# Altium schematic sheet pwr_misc.SchDoc
size B
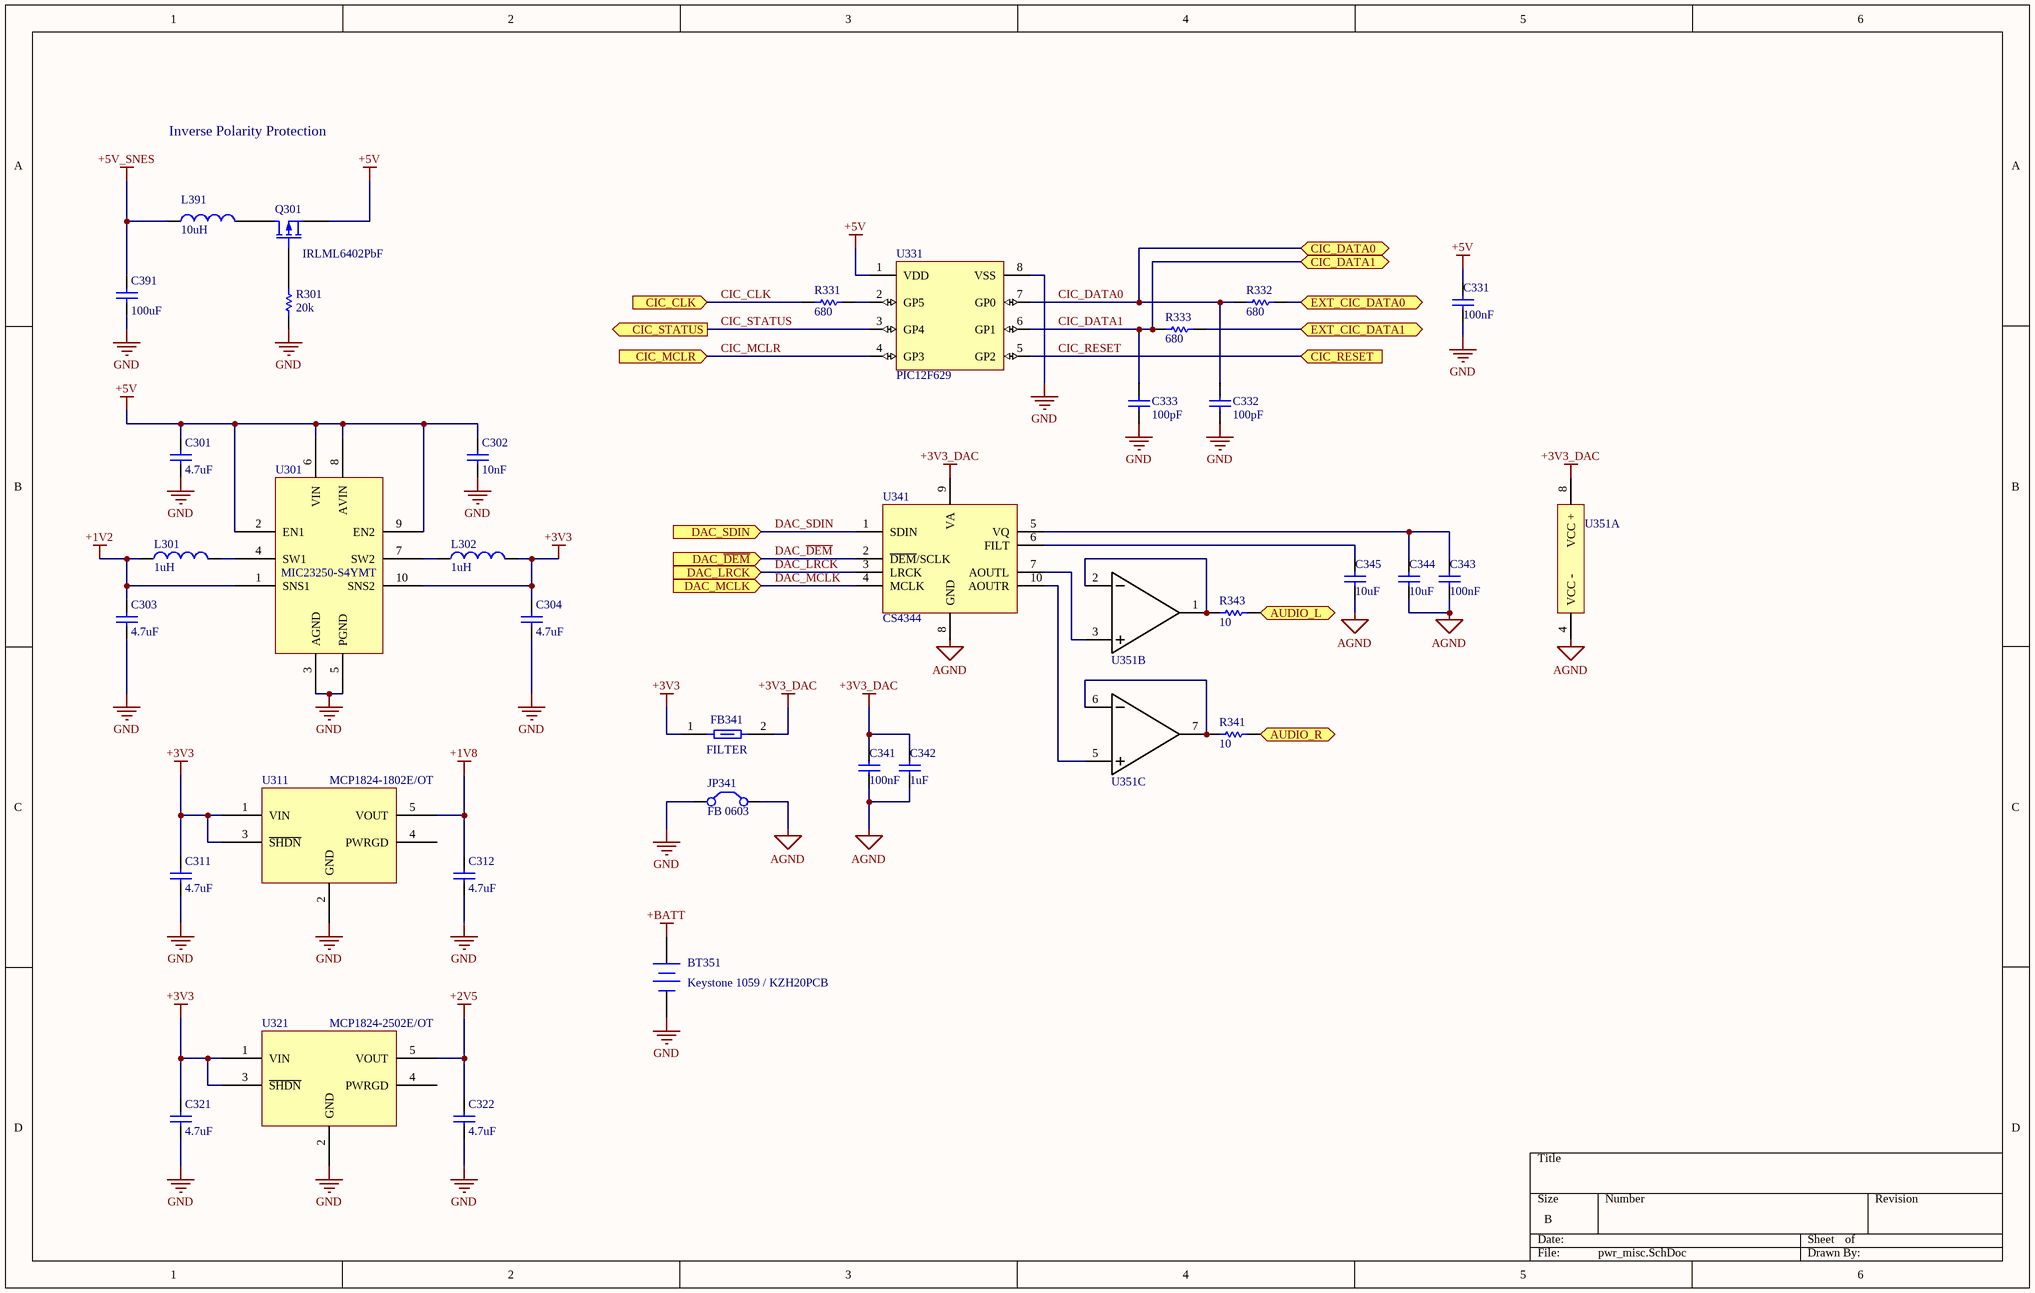
[diagram p0: pwr_misc.SchDoc]

## Parts
BT351  Keystone 1059 / KZH20PCB  [BT_KEYSTONE_1059_20MM]
C301  4.7uF  [SM0805]
C302  10nF  [SM0805]
C303  4.7uF  [SM0805]
C304  4.7uF  [SM0805]
C311  4.7uF  [SM0805]
C312  4.7uF  [SM0805]
C321  4.7uF  [SM0805]
C322  4.7uF  [SM0805]
C331  100nF  [SM0805]
C332  100pF  [SM0805]
C333  100pF  [SM0805]
C341  100nF  [SM0805]
C342  1uF  [SM0805]
C343  100nF  [SM0805]
C344  10uF  [SM0805]
C345  10uF  [SM0805]
C391  100uF  [SM1210]
FB341  FILTER  [SM0805]
JP341  FB 0603  [JUMPER]
L301  1uH  [SM1210L]
L302  1uH  [SM1210L]
L391  10uH  [SM1210L]
Q301  IRLML6402PbF  [SOT23DGS]
R301  20k  [SM0805]
R331  680  [SM0805]
R332  680  [SM0805]
R333  680  [SM0805]
R341  10  [SM0805]
R343  10  [SM0805]
U301  MIC23250-S4YMT  [QFN10-2x2_LONGPADS]
U311  MCP1824-1802E/OT  [SOT23-5_LARGEPADS]
U321  MCP1824-2502E/OT  [SOT23-5_LARGEPADS]
U331  PIC12F629  [DIP-8__300]
U341  CS4344  [TSSOP10]
U351  TS922  [SOIC127P600X175-8N]  (value not drawn)  (parts A,B,C of 3)

## Ports
AUDIO_L (out), AUDIO_R (out), CIC_CLK (in), CIC_DATA0 (bidir), CIC_DATA1 (bidir), CIC_MCLR (in), CIC_RESET (in), CIC_STATUS (out), DAC_LRCK (in), DAC_MCLK (in), DAC_SDIN (in), DAC_~{DEM} (in), EXT_CIC_DATA0 (bidir), EXT_CIC_DATA1 (bidir)

## Nets
+1V2: C303.1 L301.1 U301.1(SNS1)
+1V8: C312.1 U311.5(VOUT)
+2V5: C322.1 U321.5(VOUT)
+3V3: C304.1 C311.1 C321.1 FB341.1 L302.2 U301.10(SNS2) U311.1(VIN) U311.3(~{SHDN}) U321.1(VIN) U321.3(~{SHDN})
+3V3_DAC: C341.1 C342.1 FB341.2 U341.9(VA) U351.8(VCC_+)
+5V: C301.1 C302.1 C331.1 Q301.3(S) U301.2(EN1) U301.6(VIN) U301.8(AVIN) U301.9(EN2) U331.1(VDD)
+5V_SNES: C391.1 L391.1
+BATT: BT351.1(+)
AGND: C341.2 C342.2 C343.2 C344.2 C345.2 JP341.2(C2) U341.8(GND) U351.4(VCC_-)
GND: BT351.2(-) C301.2 C302.2 C303.2 C304.2 C311.2 C312.2 C321.2 C322.2 C331.2 C332.2 C333.2 C391.2 JP341.1(C1) R301.1 U301.3(AGND) U301.5(PGND) U311.2(GND) U321.2(GND) U331.8(VSS)
AUDIO_L: R343.1 ; port AUDIO_L
AUDIO_R: R341.1 ; port AUDIO_R
CIC_CLK: R331.2 ; port CIC_CLK
CIC_DATA0: C332.1 R332.1 U331.7(GP0) ; port CIC_DATA0
CIC_DATA1: C333.1 R333.2 U331.6(GP1) ; port CIC_DATA1
CIC_MCLR: U331.4(GP3) ; port CIC_MCLR
CIC_RESET: U331.5(GP2) ; port CIC_RESET
CIC_STATUS: U331.3(GP4) ; port CIC_STATUS
DAC_~{DEM}: U341.2(~{DEM}/SCLK) ; port DAC_~{DEM}
DAC_LRCK: U341.3(LRCK) ; port DAC_LRCK
DAC_MCLK: U341.4(MCLK) ; port DAC_MCLK
DAC_SDIN: U341.1(SDIN) ; port DAC_SDIN
EXT_CIC_DATA0: R332.2 ; port EXT_CIC_DATA0
EXT_CIC_DATA1: R333.1 ; port EXT_CIC_DATA1
NetC343_1: C343.1 C344.1 U341.5(VQ)
NetC345_1: C345.1 U341.6(FILT)
NetL301_2: L301.2 U301.4(SW1)
NetL302_1: L302.1 U301.7(SW2)
NetL391_2: L391.2 Q301.1(D)
NetQ301_2: Q301.2(G) R301.2
NetR331_1: R331.1 U331.2(GP5)
NetR341_2: R341.2 U351.6(IN2_-) U351.7(OUT2)
NetR343_2: R343.2 U351.1(OUT1) U351.2(IN1_-)
NetU341_7: U341.7(AOUTL) U351.3(IN1_+)
NetU341_10: U341.10(AOUTR) U351.5(IN2_+)

Not connected (* = marked no-connect by the designer): U311 4(PWRGD); U321 4(PWRGD)

## Notes on the sheet
- Inverse Polarity Protection

## Library data of the parts
BT351 = Battery
C301-C304 C311 C312 C321 C322 C331-C333 C341-C345 C391 = Cap: Capacitor
  C301 C303 C304 C311 C312 C321 C322: Value: 4.7uF
  C302: Value: 10nF
  C331 C341 C343: Value: 100nF
  C332 C333: Value: 100pF
  C342: Value: 1uF
  C344 C345: Value: 10uF
  C391: Value: 100uF
JP341 = Jumper: Jumper Wire
L301 L302 L391 = Inductor
  L301 L302: Value: 1uH
  L391: Value: 10uH
Q301 = MOSFET-P: P-Channel MOSFET
R301 R331-R333 R341 R343 = Res1: Resistor
  R301: Value: 20k
  R331-R333: Value: 680
  R341 R343: Value: 10
U311 U321 = MCP1824